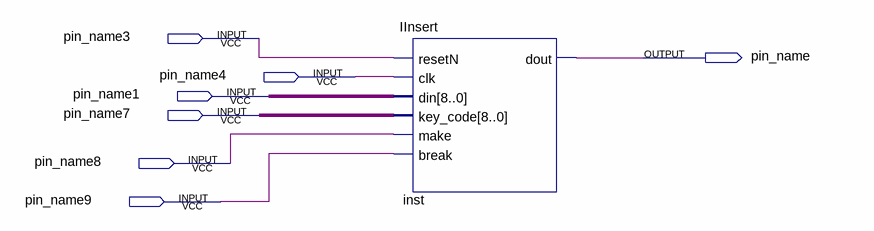
[diagram p0: schematic sheet]
// Quartus schematic KBDINTF.bdf as structural Verilog: 1 symbols, 7 pins
module KBDINTF (
  input  pin_name3,
  input  pin_name4,
  input  pin_name1,
  input  pin_name7,
  input  pin_name8,
  input  pin_name9,
  output pin_name
);

  wire [8:0] undriven, undriven_2;

  IInsert inst (
    .resetN(pin_name3), .clk(pin_name4), .din(undriven), .key_code(undriven_2), .make(pin_name8),
    .\break (pin_name9), .dout(pin_name));
endmodule
